# EAGLE design Cooling_flowSensor (EAGLE 7.6.0)
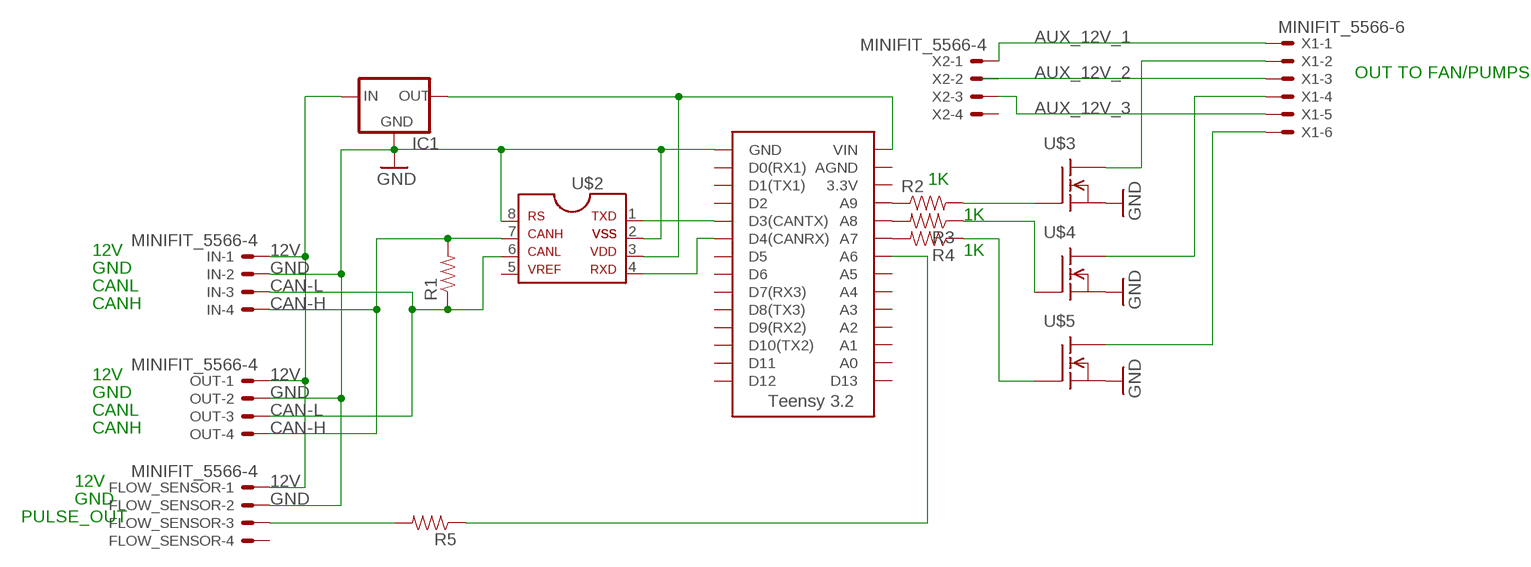
[diagram p0: schematic, sheet 1]

## Parts
FLOW_SENSOR  MINIFIT_5566-4  [MINIFIT_5566-4]
IC1  5V_REGULATOR_LM340-NLM340MPX-5.0/NOPB  [SOT223]
IN  MINIFIT_5566-4  [MINIFIT_5566-4]
OUT  MINIFIT_5566-4  [MINIFIT_5566-4]
R1  RESISTOR0805-RES  [0805]
R2  RESISTOR0805-RES  [0805]
R3  RESISTOR0805-RES  [0805]
R4  RESISTOR0805-RES  [0805]
R5  RESISTOR0805-RES  [0805]
U$1  TEENSY_3.2_SIMPLE  [TEENSY_3.2_SIMPLE]
U$2  MCP2551SOIC  [SOIC08]
U$3  PSMN011_MOSFET  [SOT669]
U$4  PSMN011_MOSFET  [SOT669]
U$5  PSMN011_MOSFET  [SOT669]
X1  MINIFIT_5566-6  [MINIFIT_5566-6]
X2  MINIFIT_5566-4  [MINIFIT_5566-4]

## Nets
5V: IC1.2(OUT) IC1.4(OUT) U$1.VIN U$2.3
12V: FLOW_SENSOR.1 IC1.3(IN) IN.1 OUT.1
AUX_12V_1: X1.1 X2.1
AUX_12V_2: X1.3
AUX_12V_3: X1.5 X2.3
CAN-H: IN.4 OUT.4 R1.2 U$2.7
CAN-L: IN.3 OUT.3 R1.1
GND: FLOW_SENSOR.2 IC1.1(GND) IN.2 OUT.2 U$1.GND U$2.2 U$2.8 U$3.1(S) U$3.2(S) U$3.3(S) U$4.1(S) U$4.2(S) U$4.3(S) U$5.1(S) U$5.2(S) U$5.3(S)
N$1: R2.1 U$1.A9
N$2: U$1.D3(CANTX) U$2.1
N$3: U$1.D4(CANRX) U$2.4
N$4: R3.2 U$1.A8
N$5: U$2.6
N$6: R4.2 U$1.A7
N$7: FLOW_SENSOR.3 R5.2
N$9: R2.2 U$3.4(G)
N$10: R5.1 U$1.A6
N$12: R3.1 U$4.4(G)
N$13: R4.1 U$5.4(G)
N$14: U$4.MB2(D) U$4.MB(D) X1.4
N$15: U$5.MB2(D) U$5.MB(D) X1.6
N$19: U$3.MB2(D) U$3.MB(D) X1.2
Unconnected: FLOW_SENSOR.4 U$1.3.3V U$1.A0 U$1.A1 U$1.A2 U$1.A3 U$1.A4 U$1.A5 U$1.AGND U$1.D0(RX1) U$1.D1(TX1) U$1.D2 U$1.D5 U$1.D6 U$1.D7(RX3) U$1.D8(TX3) U$1.D9(RX2) U$1.D10(TX2) U$1.D11 U$1.D12 U$1.D13 U$2.5 X2.2 X2.4

## Notes on the sheet
- OUT TO FAN/PUMPS
- 1K
- 1K
- 12V | 1K
- GND
- CANL
- CANH
- 12V
- GND
- CANL
- CANH
- 12V
- GND
- PULSE_OUT

## Library data of the parts
FLOW_SENSOR IN OUT X2 = HyTechDevices:MINIFIT_5566-4: Mini-Fit Junior connector 4 pole Source: http://www.molex.com; OC_FARNELL: unknown; OC_NEWARK: unknown
IC1 = HyTechDevices:5V_REGULATOR_LM340-N: Voltage Regulator 5v linear voltage regulator Datasheet <http://www.mouser.com/ProductDetail/Texas-Instruments/LM340MPX-50-NOPB/?qs=X1J7HmVL2ZGZwtTFRQ9ItA%3D%3D> MAX current out: 1.5A MAX voltage in: 35V
R1-R5 = HyTechDevices:RESISTOR: Resistor Basic schematic elements and footprints for 0603, 1206, and PTH resistors.
U$1 = HyTechDevices:TEENSY_3.2_SIMPLE: Simple version of the Teensy 3.2 board that only uses the 2 main rows of pins, not the inner pins or the pins opposite the usb port.
U$2 = HyTechDevices:MCP2551: MCP2551 High-Speed CAN Transceiver Product Webpage <https://www.microchip.com/wwwproducts/en/MCP2551> Datasheet <http://ww1.microchip.com/downloads/en/DeviceDoc/21667f.pdf> This device is outdated It is replaced by MCP2561. Comparison Page <https://www.microchip.com/wwwproducts/ProductCompare/MCP2551/MCP2561> Product Webpage <https://www.microchip.com/wwwproducts/en/MCP2561> Datasheet <http://ww1.microchip.com/downloads/en/DeviceDoc/20005167C.pdf>
U$3-U$5 = HyTechDevices:PSMN011_MOSFET: PSMN011_MOSFET Datasheet <http://www.nxp.com/documents/data_sheet/PSMN011-30YLC.pdf>
X1 = HyTechDevices:MINIFIT_5566-6: Mini-Fit Junior connector 6 pole Source: http://www.molex.com; MPN: 95566-61002; OC_FARNELL: unknown; OC_NEWARK: 22K8620

## Board
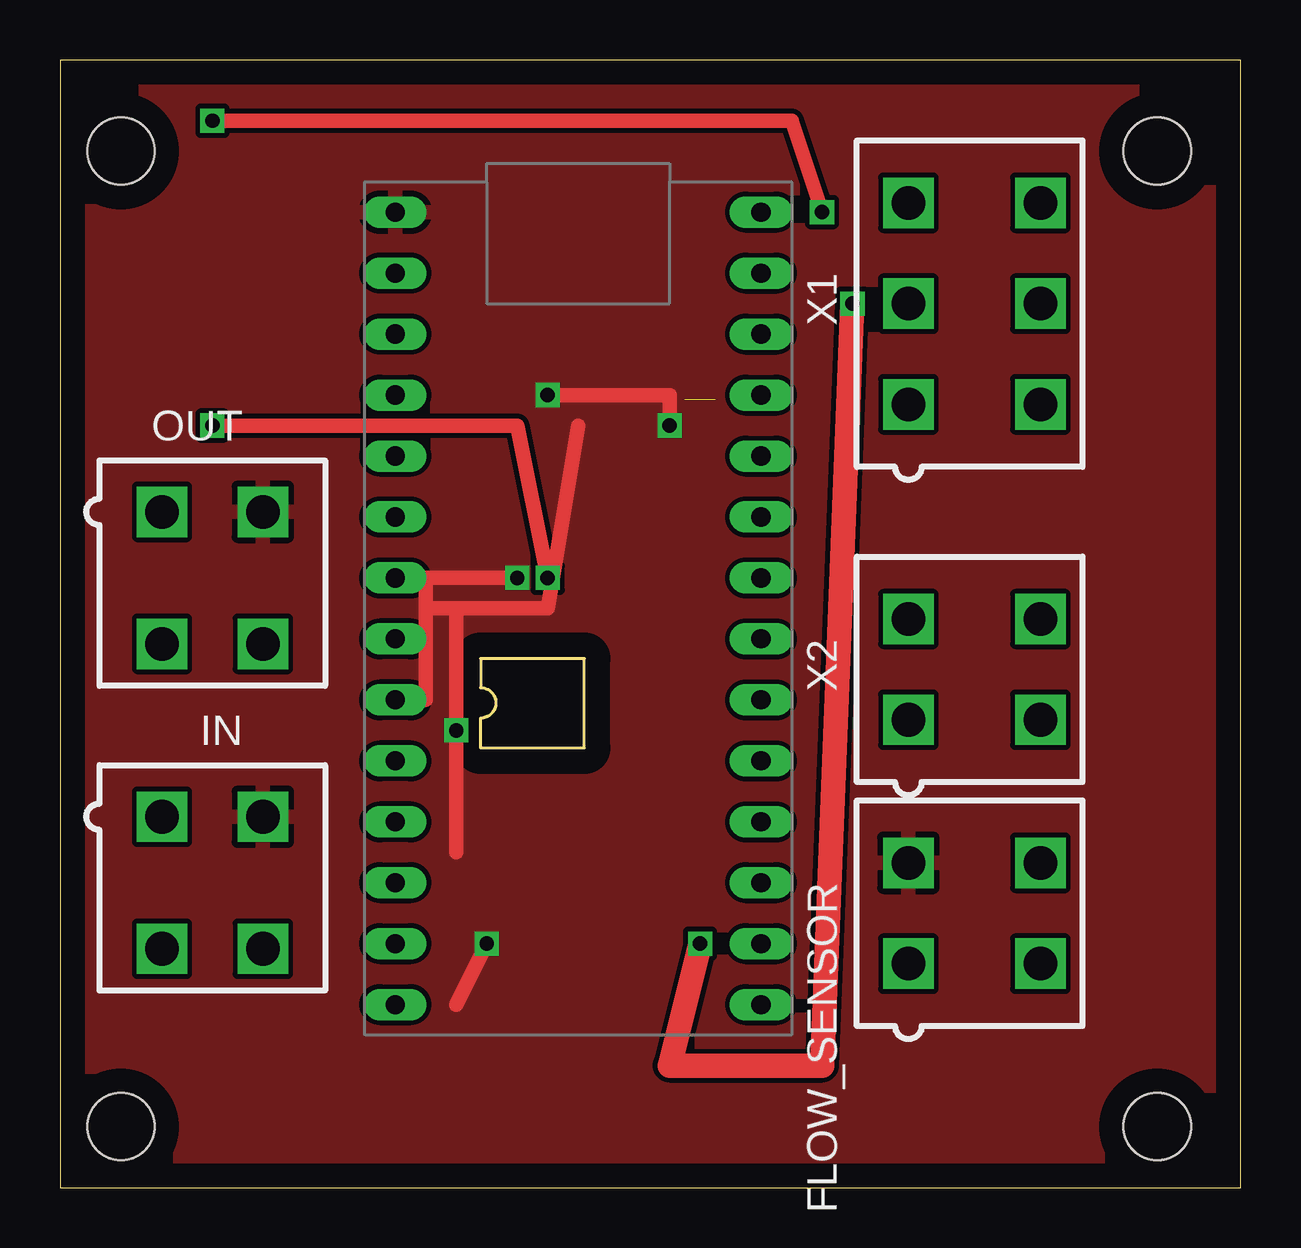
[diagram p1: board, top side]
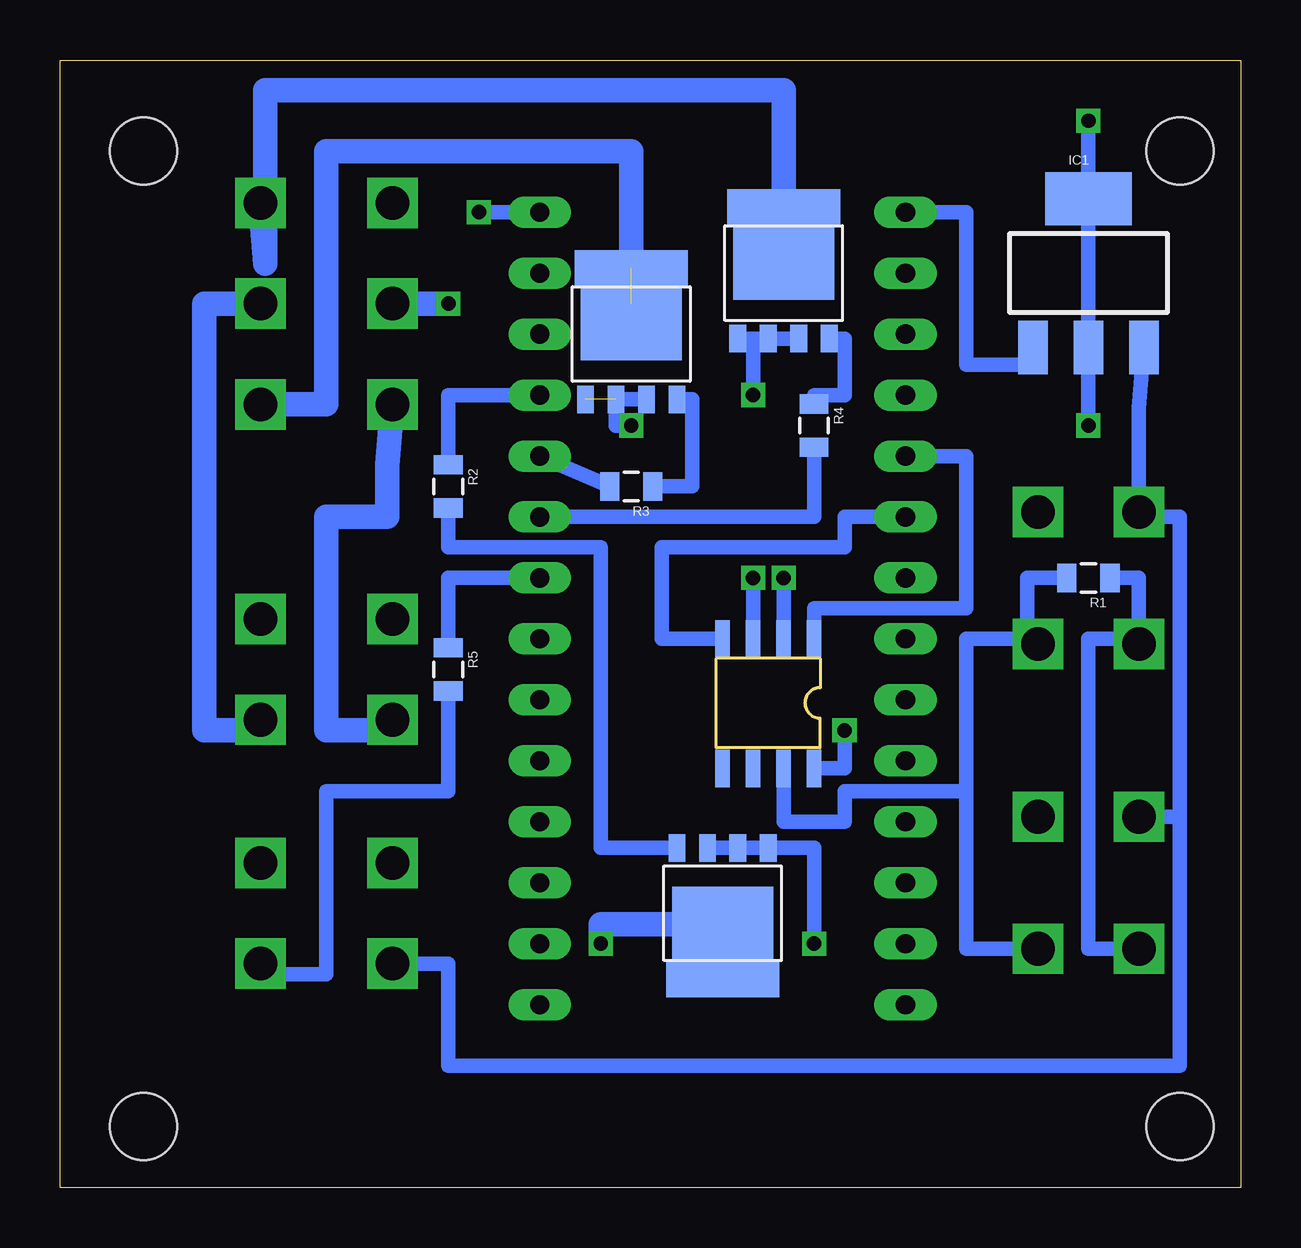
[diagram p2: board, bottom side, seen from below]

Size 49.2 x 46.98 mm. Coordinates in mm from the lower left corner, seen from the top.
Outline: 0,0 49.2,0 49.2,46.98 0,46.98 0,0
Copper layers (1*16): Top 0.035mm / dielectric 1.5mm / Bottom 0.035mm
Design rules "default": minimum track width 10mil, minimum drill 24mil, track to track 8mil, track to pad 8mil, pad to pad 8mil, via to via 8mil, smd to smd 8mil, copper to edge 40mil, drill to drill 8mil, minimum pad ring 10mil, minimum via ring 8mil, stop-mask expansion 4mil, vias tented up to drill 0mil, thermal gap 10mil
Holes 2.8 mm at 2.54,43.18 45.72,43.18 45.72,2.54 2.54,2.54

### Footprints (pad centres in the part's own frame; a part is rotated, then mirrored left to right if it is on the bottom)
MINIFIT_5566-4 = drill 1.4 square: 1 2.1,-2.75; 2 -2.1,-2.75; 3 2.1,2.75; 4 -2.1,2.75
SOT223 = smd 1.219 x 2.235: 1 -2.311,-3.099; 2 0,-3.099; 3 2.311,-3.099 | smd 3.6 x 2.2: 4 0,3.099
0805 = smd 0.8 x 1.2: 1 -0.9,0; 2 0.9,0
TEENSY_3.2_SIMPLE = drill 0.8 long: 3.3V 16.51,29.21; A0 16.51,3.81; A1 16.51,6.35; A2 16.51,8.89; A3 16.51,11.43; A4 16.51,13.97; A5 16.51,16.51; A6 16.51,19.05; A7 16.51,21.59; A8 16.51,24.13; A9 16.51,26.67; AGND 16.51,31.75; D0(RX1) 1.27,31.75; D1(TX1) 1.27,29.21; D2 1.27,26.67; D3(CANTX) 1.27,24.13; D4(CANRX) 1.27,21.59; D5 1.27,19.05; D6 1.27,16.51; D7(RX3) 1.27,13.97; D8(TX3) 1.27,11.43; D9(RX2) 1.27,8.89; D10(TX2) 1.27,6.35; D11 1.27,3.81; D12 1.27,1.27; D13 16.51,1.27; GND 1.27,34.29; VIN 16.51,34.29
SOIC08 = smd 0.6 x 1.55: 1 0,0; 2 1.27,0; 3 2.54,0; 4 3.81,0; 5 3.81,5.4; 6 2.54,5.4; 7 1.27,5.4; 8 0,5.4
SOT669 = smd 0.7 x 1.15: 1 -1.905,-2.725; 2 -0.635,-2.725; 3 0.635,-2.725; 4 1.905,-2.725 | smd 4.2 x 3.1: MB 0,0.45 | smd 4.7 x 1.5: MB2 0,2.75
MINIFIT_5566-6 = drill 1.4 square: 1 4.2,-2.75; 2 0,-2.75; 3 -4.2,-2.75; 4 4.2,2.75; 5 0,2.75; 6 -4.2,2.75

### Placement (x,y rotation side)
FLOW_SENSOR  38.1,11.43 270 top
IC1  6.35,38.1 0 bottom
IN  6.35,12.7 180 top
OUT  6.35,25.4 180 top
R1  6.35,25.4 180 bottom
R2  33.02,29.21 270 bottom
R3  25.4,29.21 180 bottom
R4  17.78,31.75 270 bottom
R5  33.02,21.59 270 bottom
U$1  12.7,6.35 0 top
U$2  17.78,22.86 180 bottom
U$3  21.59,11.43 180 bottom
U$4  25.4,35.56 0 bottom
U$5  19.05,38.1 0 bottom
X1  38.1,36.83 270 top
X2  38.1,21.59 270 top

### Tracks (layer width: path | path; a pad name or v marks a point on that pad's centre or on a via)
5V  (via drill 0.6)
  Top 0.61: v6.35,44.45 30.48,44.45 v31.75,40.64 | v6.35,31.75 19.05,31.75 v20.32,25.4
  Bottom 0.61: v6.35,44.45 IC1.4 IC1.2 v6.35,31.75 | U$1.VIN v31.75,40.64 | U$2.3 v20.32,25.4
12V
  Bottom 0.61: IN.1 2.54,15.45 | 2.54,15.45 2.54,27.94 4.25,27.94 OUT.1 4.25,32.46 IC1.3 | FLOW_SENSOR.1 33.02,9.33 33.02,5.08 2.54,5.08 2.54,15.45
AUX_12V_1
  Bottom 1.016: X1.1 35.56,30.09 35.56,27.94 38.1,27.94 38.1,19.05 35.35,19.05 X2.1
AUX_12V_3
  Bottom 1.016: X1.5 43.18,36.83 43.18,19.05 40.85,19.05 X2.3
CAN-H
  Bottom 0.61: OUT.4 8.89,22.65 8.89,22.86 | 8.89,22.86 8.89,25.4 R1.2 | IN.4 11.43,9.95 11.43,16.51 | 11.43,16.51 11.43,22.86 8.89,22.86 | U$2.7 19.05,15.24 16.51,15.24 16.51,16.51 11.43,16.51
CAN-L
  Bottom 0.61: R1.1 4.25,25.4 OUT.3 4.25,22.86 6.35,22.86 6.35,9.95 IN.3
GND  (via drill 0.6)  (1 unrouted)
  Top 0.61: 15.24,20.32 15.24,24.13 | v17.78,10.16 16.51,7.62 | v19.05,25.4 15.24,25.4 15.24,24.13 | 15.24,24.13 16.51,24.13 | 16.51,24.13 v16.51,19.05 16.51,13.97 | 21.59,31.75 20.32,24.13 16.51,24.13 | v20.32,33.02 25.4,33.02 v25.4,31.75
  Bottom 0.61: U$1.GND 11.43,40.64 11.43,34.29 8.66,34.29 IC1.1 | v17.78,10.16 17.78,14.16 U$3.1 U$3.2 U$3.3 | U$2.2 v19.05,25.4 | U$2.8 16.51,17.46 v16.51,19.05 | U$5.3 U$5.2 U$5.1 20.32,35.38 v20.32,33.02 | U$4.3 U$4.2 26.04,31.75 v25.4,31.75
  cutout Bottom: -1.27,48.26 50.8,48.26 50.8,46.99 50.8,-1.27 -1.27,-1.27 -1.27,46.99
  pour Top: -1.27,49.53 52.07,49.53 52.07,-2.54 -1.27,-2.54
N$1
  Bottom 0.61: U$1.A9 33.02,33.02 R2.1
N$2
  Bottom 0.61: U$1.D3(CANTX) 11.43,30.48 11.43,24.13 17.78,24.13 U$2.1
N$3
  Bottom 0.61: U$2.4 24.13,22.86 24.13,26.67 16.51,26.67 16.51,27.94 U$1.D4(CANRX)
N$4
  Bottom 0.61: R3.2 U$1.A8
N$6
  Bottom 0.61: R4.2 17.78,27.94 U$1.A7
N$7
  Bottom 0.61: FLOW_SENSOR.3 40.85,8.89 38.1,8.89 38.1,16.51 33.02,16.51 R5.2
N$9
  Bottom 0.61: R2.2 33.02,26.67 26.67,26.67 26.67,14.16 U$3.4
N$10
  Bottom 0.61: U$1.A6 33.02,25.4 R5.1
N$12
  Bottom 0.61: U$4.4 22.86,32.84 22.86,29.21 R3.1
N$13
  Bottom 0.61: U$5.4 16.51,35.38 16.51,33.02 17.78,33.02 R4.1
N$14  (2 unrouted)
  Bottom 1.016: X1.4 38.1,32.63 38.1,43.18 25.4,43.18 25.4,38.1 | U$4.MB 25.4,36.83
N$15
  Bottom 1.016: U$5.MB U$5.MB2 19.05,45.72 40.64,45.72 40.64,38.49 X1.6
N$19  (via drill 0.6)
  Top 1.016: v26.67,10.16 25.4,5.08 31.75,5.08 v33.02,36.83
  Bottom 0.61: U$3.MB U$3.MB2
  Bottom 1.016: U$3.MB 26.67,10.98 v26.67,10.16 | v33.02,36.83 X1.2